# Altium schematic sheet DCDC-TPS54361QDPRRQ1.SchDoc
size A3; Revision: 8
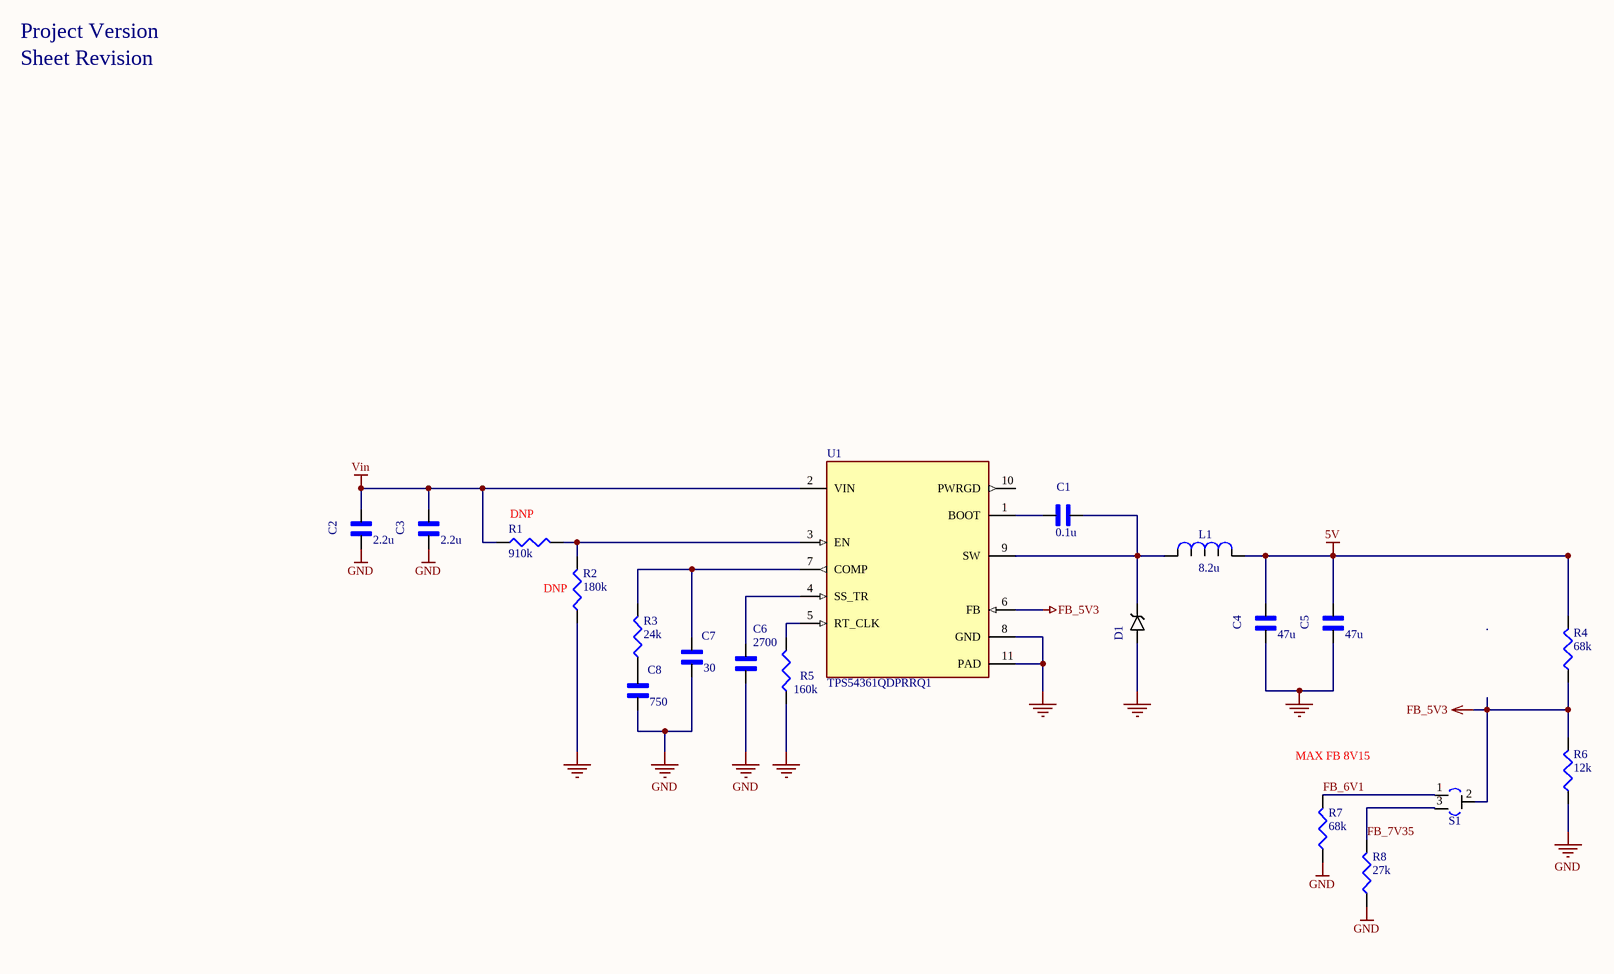
[diagram p0: DCDC-TPS54361QDPRRQ1.SchDoc]

## Parts
C1  value 0.1u  [*CAPC1608X90]  (hidden comment: GX035C104MAT2-500)
C2  value 2.2u  [*CAP3216X125N]  (hidden comment: GRM31CR71H225KA88L)
C3  value 2.2u  [*CAP3216X125N]  (hidden comment: GRM31CR71H225KA88L)
C4  value 47u  [*CAPC3216X125N]  (hidden comment: GRM31CR61A476KE15L)
C5  value 47u  [*CAPC3216X125N]  (hidden comment: GRM31CR61A476KE15L)
C6  value 2700  [CAP0603]  (hidden comment: GRM188R71H272KA01D)
C7  value 30  [CAP0603]  (hidden comment: MLCC30pFNPO50V5%0603)
C8  value 750  [CAP0603]  (hidden comment: GRM1885C1H751JA01D)
D1  SK56  [*SMB_P6SMB62AT3G(Primary)]  (value not drawn)
L1  value 8.2u  [*IND_IHLP_2525_CZ]  (hidden comment: IHLP2525CZER8R2M01)
R1  value 910k  Instructions: DNP  [J1-0603]  (hidden comment: RC0603FR-07910KL)
R2  value 180k  Instructions: DNP  [J1-0603]  (hidden comment: RC0603FR-07180KL)
R3  value 24k  [J1-0603]  (hidden comment: RC0603FR-0724KL)
R4  value 68k  [J1-0603]  (hidden comment: RC0603FR-0762KL)
R5  value 160k  [J1-0603]  (hidden comment: RC0603FR-07160KL)
R6  value 12k  [J1-0603]  (hidden comment: Res3)
R7  value 68k  [J1-0603]  (hidden comment: RC0603FR-0762KL)
R8  value 27k  [J1-0603]  (hidden comment: RC0603FR-0727KL)
S1  selector  [SELECTOR]  (value not drawn)
U1  TPS54361QDPRRQ1  [DPR0010A]

## Nets
5V: C4.2 C5.2 L1.1 R4.2
FB_5V3: R4.1 R6.2 S1.2(MID) U1.6(FB)
GND: C2.2 C3.2 C4.1 C5.1 C6.1 C7.1 C8.1 D1.A R2.1 R5.1 R6.1 R7.1 R8.1 U1.8(GND) U1.11(PAD)
Vin: C2.1 C3.1 R1.1 U1.2(VIN)
FB_6V1: R7.2 S1.1(IN1)
FB_7V35: R8.2 S1.3(IN3)
NetC1_1: C1.1 D1.C L1.2 U1.9(SW)
NetC1_2: C1.2 U1.1(BOOT)
NetC6_2: C6.2 U1.4(SS_TR)
NetC7_2: C7.2 R3.2 U1.7(COMP)
NetC8_2: C8.2 R3.1
NetR1_2: R1.2 R2.2 U1.3(EN)
NetR5_2: R5.2 U1.5(RT_CLK)

Not connected (* = marked no-connect by the designer): U1 10(PWRGD)

## Notes on the sheet
- Project Version
- Sheet Revision
- (near R7) MAX FB 8V15

## Library data of the parts
C1 = GX035C104MAT2-500: Cap Thin Film 0.1uf 50v 0603; MF: AVX; Type: SMD; Pacage Metric: 1608; ChipDip_Price: 10; Package: 0603 AVX; MP: GX035C104MAT2-500; SnapEDA_Link: https://www.snapeda.com/parts/GX035C104MAT2-500/AVX/view-part/?ref=snap; ChipDip_Link: https://www.chipdip.ru/product0/9000410929; Price: 0.024
C2 C3 = GRM31CR71H225KA88L: 1206 2.2 uF 50 V В±10% Tolerance X7R SMT Multilayer Ceramic Capacitor; MF: Murata Electronics; Type: SMD; ChipDip_Price: 12; Package: 1206 Murata; SnapEDA_Link: https://www.snapeda.com/parts/GRM31CR71H225KA88L/Murata%20Electronics%20North%20America/view-part/?ref=snap; MP: GRM31CR71H225KA88L; ChipDip_Link: https://www.chipdip.ru/product/grm31cr71h225ka88l; Price: 0.16
C4 C5 = GRM31CR61A476KE15L: Multilayer Ceramic Capacitor, GRM Series, 47 - F, - 10%, X5R, 10 V, 1206 [3216 Metric]; MF: Murata Electronics; Type: SMD; ChipDip_Price: 11; Package: 1206 Murata Electronics; MP: GRM31CR61A476KE15L; SnapEDA_Link: https://www.snapeda.com/parts/GRM31CR61A476KE15L/Murata%20Electronics%20North%20America/view-part/?ref=snap; ChipDip_Link: https://www.chipdip.ru/product0/8001779807; Price: 0.2
C6 = GRM188R71H272KA01D: Конденсатор 0603 2700 пФ 50В Конденсатор керамический; Type: SMD; ChipDip_Price: 4; Package: 0603; MP: GRM188R71H272KA01D; ChipDip_Link: https://www.chipdip.ru/product/grm1885c1h1r8c; HelpURL: https://static.chipdip.ru/lib/428/DOC005428493.pdf; SnapEDA_Link: https://www.snapeda.com/parts/GRM1885C1H1R8CZ01J/Murata/view-part/3819068/?ref=snap
C7 = MLCC30pFNPO50V5%0603: Конденсатор 0603 30пФ 50В Конденсатор керамический smd 30 пФ 0603; ChipDip_Price: 4; Package: 0603; MP: MLCC30pFNPO50V5%0603; SnapEDA_Link: https://www.snapeda.com/parts/GRM1885C1H1R8CZ01J/Murata/view-part/3819068/?ref=snap; Type: SMD; ChipDip_Link: https://www.chipdip.ru/product/grm1885c1h1r8c; HelpURL: https://static.chipdip.ru/lib/428/DOC005428493.pdf
C8 = GRM1885C1H751JA01D: Конденсатор 0603 750 пФ 50В Конденсатор керамический; Type: SMD; ChipDip_Price: 4; Package: 0603; MP: GRM1885C1H751JA01D; SnapEDA_Link: https://www.snapeda.com/parts/GRM1885C1H1R8CZ01J/Murata/view-part/3819068/?ref=snap; ChipDip_Link: https://www.chipdip.ru/product/grm1885c1h1r8c; HelpURL: https://static.chipdip.ru/lib/428/DOC005428493.pdf
D1 = SK56: Диод Шоттки 5А 60В [SMB / DO-214AA]; MF: Littelfuse Inc.; Type: SMD; MP: SK56; Package: DO-214 Littelfuse; SnapEDA_Link: https://www.snapeda.com/parts/P6SMB62AT3G/Littelfuse%20Inc./view-part/?ref=snap; Value: *; ChipDip_Link: https://www.chipdip.ru/product/sk56; Price: 0.249
L1 = IHLP2525CZER8R2M01: IHLP2525CZER8R2M01, 8.2uH 4A 20% Low Profile High Current SMT Inductor, Индуктивность; MF: Vishay Dale; Type: SMD; SnapEDA_Link: https://www.snapeda.com/parts/IHLP2525CZER100M01/Vishay%20Dale/view-part/?ref=snap; MP: IHLP2525CZER8R2M01; Package: Nonstandard Vishay
R1 = RC0603FR-07910KL: 910 kOhms ±1% 0.1W, 1/10W Chip Resistor 0603 (1608 Metric) Moisture Resistant Thick Film; MF: Yageo or NXP; Package: R0603; Type: SMD; HelpURL: https://www.yageo.com/upload/media/product/productsearch/datasheet/rchip/PYu-RC_Group_51_RoHS_L_10.pdf; MP: RC0603FR-07910KL
R2 = RC0603FR-07180KL: 180 kOhms ±1% 0.1W, 1/10W Chip Resistor 0603 (1608 Metric) Moisture Resistant Thick Film; MF: Yageo or NXP; Package: R0603; Type: SMD; HelpURL: https://www.yageo.com/upload/media/product/productsearch/datasheet/rchip/PYu-RC_Group_51_RoHS_L_10.pdf; MP: RC0603FR-07180KL
R3 = RC0603FR-0724KL: Резистор 0603  24 kOhms ±1% 0.1W, 1/10W Chip Resistor 0603 (1608 Metric) Thick Film; Pacage Metric: 1608; MF: Yageo or NXP; ChipDip_Link: https://www.chipdip.ru/product0/9000079736; HelpURL: https://www.yageo.com/upload/media/product/productsearch/datasheet/rchip/PYu-RC_Group_51_RoHS_L_10.pdf; Package: R0603; Type: SMD; MP: RC0603FR-0724KL; SnapEDA_Link: https://www.snapeda.com/parts/RC0603FR-074K7L/Yageo/view-part/?ref=dk&t=RC0603FR-074K7L&con_ref=None
R4 R7 = RC0603FR-0768KL: Резистор 0603  68 kOhms ±1% 0.1W, 1/10W Chip Resistor 0603 (1608 Metric) Moisture Resistant Thick Film; Pacage Metric: 1608; MF: Yageo or NXP; ChipDip_Link: https://www.chipdip.ru/product1/8001792354; HelpURL: https://www.yageo.com/upload/media/product/productsearch/datasheet/rchip/PYu-RC_Group_51_RoHS_L_10.pdf; Package: R0603; Type: SMD; MP: RC0603FR-0768KL
R5 = RC0603FR-07160KL: 160 kOhms ±1% 0.1W, 1/10W Chip Resistor 0603 (1608 Metric) Moisture Resistant Thick Film; MF: Yageo or NXP; ChipDip_Link: https://www.chipdip.ru/product/rc0603fr-07160kl; HelpURL: https://www.yageo.com/upload/media/product/productsearch/datasheet/rchip/PYu-RC_Group_51_RoHS_L_10.pdf; Package: R0603; Type: SMD; MP: RC0603FR-07160KL
R6 = Res3: Resistor; Pacage Metric: 1608; MP: 4.7K 1% 0603; ChipDip_Link: https://www.chipdip.ru/product0/9000079736; HelpURL: https://www.chipdip.ru/product0/9000079736; Package: R0603; Type: SMD
R8 = RC0603FR-0727KL: Резистор 0603  27 kOhms ±1% 0.1W, 1/10W Chip Resistor 0603 (1608 Metric) Thick Film; Pacage Metric: 1608; MF: Yageo or NXP; ChipDip_Link: https://www.chipdip.ru/product0/9000079736; HelpURL: https://www.yageo.com/upload/media/product/productsearch/datasheet/rchip/PYu-RC_Group_51_RoHS_L_10.pdf; Package: R0603; Type: SMD; MP: RC0603FR-0727KL; SnapEDA_Link: https://www.snapeda.com/parts/RC0603FR-074K7L/Yageo/view-part/?ref=dk&t=RC0603FR-074K7L&con_ref=None
S1 = selector: Instructions: DNP
U1 = TPS54361QDPRRQ1: 4.5-V to 60-V Input, 3.5-A, Step Down DC-DC Converter with Soft-Start 10-WSON -40 to 125; MF: Texas Instruments; Price: None; SnapEDA_Link: https://www.snapeda.com/parts/TPS54361QDPRRQ1/Texas+Instruments/view-part/?ref=snap; Purchase-URL: https://pricing.snapeda.com/search/part/TPS54361QDPRRQ1/?ref=eda; Check_prices: https://www.snapeda.com/parts/TPS54361QDPRRQ1/Texas+Instruments/view-part/?ref=eda; MP: TPS54361QDPRRQ1; Value: *; Availability: In Stock; Package: WSON-10 Texas Instruments